# EAGLE design afe_revA (EAGLE 6.5.0)
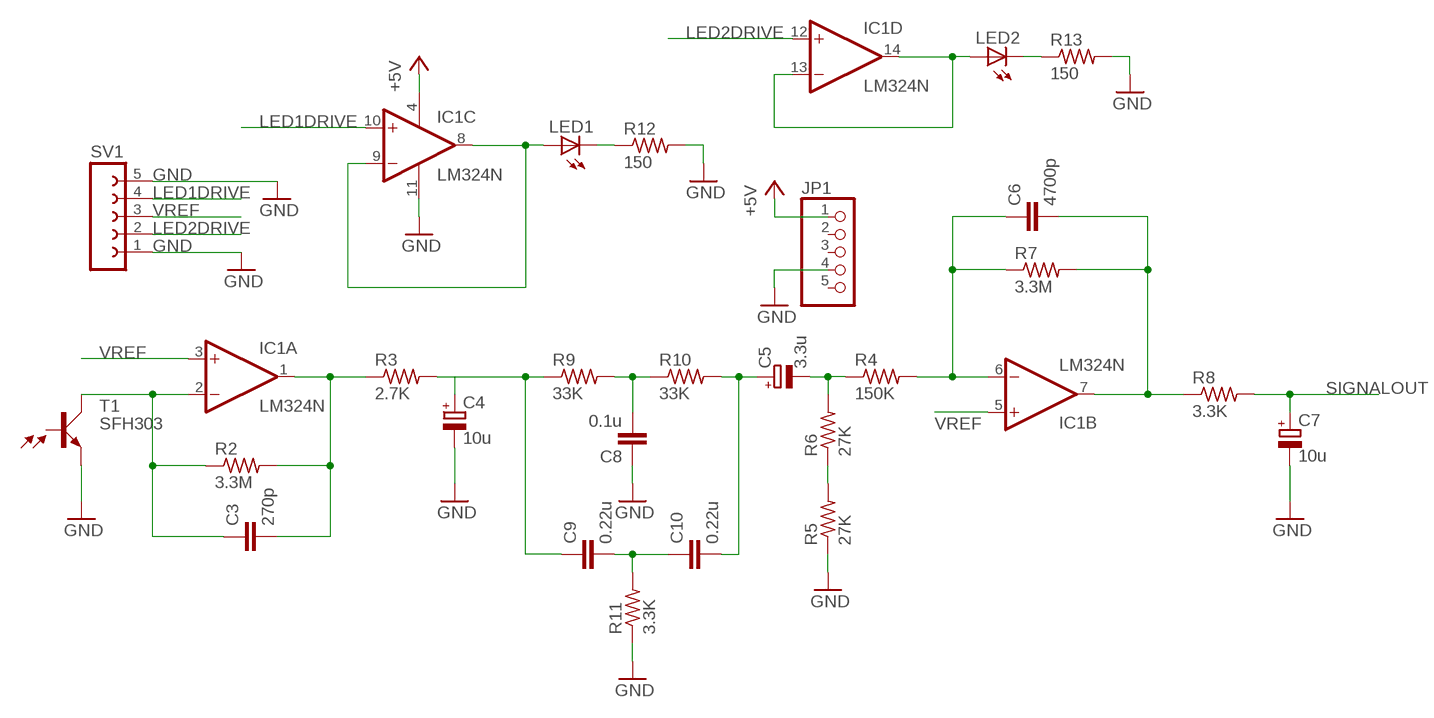
[diagram p0: schematic, sheet 1]

## Parts
C3  270p  C-EU025-024X044  [C025-024X044]
C4  10u  CPOL-EUE2.5-5  [E2,5-5]
C5  3.3u  CPOL-EUE2.5-5  [E2,5-5]
C6  4700p  C-EU025-024X044  [C025-024X044]
C7  10u  CPOL-EUE2.5-5  [E2,5-5]
C8  0.1u  C-EU025-024X044  [C025-024X044]
C9  0.22u  C-EU025-024X044  [C025-024X044]
C10  0.22u  C-EU025-024X044  [C025-024X044]
IC1  LM324N  [DIL14]
JP1  PINHD-1X5  [1X05]
LED1  LED5MM  [LED5MM]
LED2  LED5MM  [LED5MM]
R2  3.3M  R-US_0204/5  [0204/5]
R3  2.7K  R-US_0204/5  [0204/5]
R4  150K  R-US_0204/5  [0204/5]
R5  27K  R-US_0204/5  [0204/5]
R6  27K  R-US_0204/5  [0204/5]
R7  3.3M  R-US_0204/5  [0204/5]
R8  3.3K  R-US_0204/5  [0204/5]
R9  33K  R-US_0204/5  [0204/5]
R10  33K  R-US_0204/5  [0204/5]
R11  3.3K  R-US_0204/5  [0204/5]
R12  150  R-US_0204/5  [0204/5]
R13  150  R-US_0204/5  [0204/5]
SV1  FE05-1  [FE05-1]
T1  SFH303  [SFH303]

## Nets
+5V: IC1.4(P:V+) JP1.1
GND: C4.- C7.- C8.1 IC1.11(P:V-) JP1.4 R5.1 R11.1 R12.2 R13.2 SV1.1 SV1.5 T1.1(E)
LED1DRIVE: IC1.10(C:+IN) SV1.4
LED2DRIVE: IC1.12(D:+IN) SV1.2
N$1: C3.2 IC1.1(A:OUT) R2.2 R3.1
N$2: C3.1 IC1.2(A:-IN) R2.1 T1.2(C)
N$3: C4.+ C9.1 R3.2 R9.1
N$4: C5.- R4.1 R6.2
N$5: R5.2 R6.1
N$6: C6.1 IC1.6(B:-IN) R4.2 R7.1
N$7: C6.2 IC1.7(B:OUT) R7.2 R8.1
N$8: C8.2 R9.2 R10.1
N$9: C5.+ C10.2 R10.2
N$10: C9.2 C10.1 R11.2
N$11: IC1.13(D:-IN) IC1.14(D:OUT) LED2.A
N$12: IC1.8(C:OUT) IC1.9(C:-IN) LED1.A
N$13: LED1.K(C) R12.1
N$14: LED2.K(C) R13.1
SIGNALOUT: C7.+ R8.2
VREF: IC1.3(A:+IN) IC1.5(B:+IN) SV1.3
Unconnected: JP1.2 JP1.3 JP1.5 T1.3(B)

## Library data of the parts
C3 C6 C8-C10 = rcl:C-EU: CAPACITOR, European symbol
C4 C5 C7 = rcl:CPOL-EU: POLARIZED CAPACITOR, European symbol
IC1 = linear:LM324: OP AMP
JP1 = pinhead:PINHD-1X5: PIN HEADER
LED1 LED2 = led:LED: LED OSRAM: - CHIPLED LG R971, LG N971, LY N971, LG Q971, LY Q971, LO R971, LY R971 LH N974, LH R974 LS Q976, LO Q976, LY Q976 LO Q996 - Hyper CHIPLED LW Q18S LB Q993, LB Q99A, LB R99A - SideLED LS A670, LO A670, LY A670, LG A670, LP A670 LB A673, LV A673, LT A673, LW A673 LH A674 LY A675 LS A676, LA A676, LO A676, LY A676, LW A676 LS A679, LY A679, LG A679 - Hyper Micro SIDELED® LS Y876, LA Y876, LO Y876, LY Y876 LT Y87S - SmartLED LW L88C, LW L88S LB L89C, LB L89S, LG L890 LS L89K, LO L89K, LY L89K LS L896, LA L896, LO L896, LY L896 - TOPLED LS T670, LO T670, LY T670, LG T670, LP T670 LSG T670, LSP T670, LSY T670, LOP T670, LYG T670 LG T671, LOG T671, LSG T671 LB T673, LV T673, LT T673, LW T673 LH T674 LS T676, LA T676, LO T676, LY T676, LB T676, LH T676, LSB T676, LW T676 LB T67C, LV T67C, LT T67C, LS T67K, LO T67K, LY T67K, LW E67C LS E67B, LA E67B, LO E67B, LY E67B, LB E67C, LV E67C, LT E67C LW T67C LS T679, LY T679, LG T679 LS T770, LO T770, LY T770, LG T770, LP T770 LB T773, LV T773, LT T773, LW T773 LH T774 LS E675, LA E675, LY E675, LS T675 LS T776, LA T776, LO T776, LY T776, LB T776 LHGB T686 LT T68C, LB T68C - Hyper Mini TOPLED® LB M676 - Mini TOPLED Santana® LG M470 LS M47K, LO M47K, LY M47K Source: http://www.osram.convergy.de LUXEON: - LUMILED® LXK2-PW12-R00, LXK2-PW12-S00, LXK2-PW14-U00, LXK2-PW14-V00 LXK2-PM12-R00, LXK2-PM12-S00, LXK2-PM14-U00 LXK2-PE12-Q00, LXK2-PE12-R00, LXK2-PE12-S00, LXK2-PE14-T00, LXK2-PE14-U00 LXK2-PB12-K00, LXK2-PB12-L00, LXK2-PB12-M00, LXK2-PB14-N00, LXK2-PB14-P00, LXK2-PB14-Q00 LXK2-PR12-L00, LXK2-PR12-M00, LXK2-PR14-Q00, LXK2-PR14-R00 LXK2-PD12-Q00, LXK2-PD12-R00, LXK2-PD12-S00 LXK2-PH12-R00, LXK2-PH12-S00 LXK2-PL12-P00, LXK2-PL12-Q00, LXK2-PL12-R00 Source: www.luxeon.com KINGBRIGHT: KA-3528ASYC Source: www.kingbright.com
R2-R13 = rcl:R-US_: RESISTOR, American symbol
SV1 = con-lsta:FE05-1: FEMALE HEADER; OC_FARNELL: unknown; OC_NEWARK: unknown
T1 = opto-trans-siemens:SFH303: Silicium NPN Phototransistor Source: Siemens; OC_FARNELL: unknown; OC_NEWARK: unknown

## Board
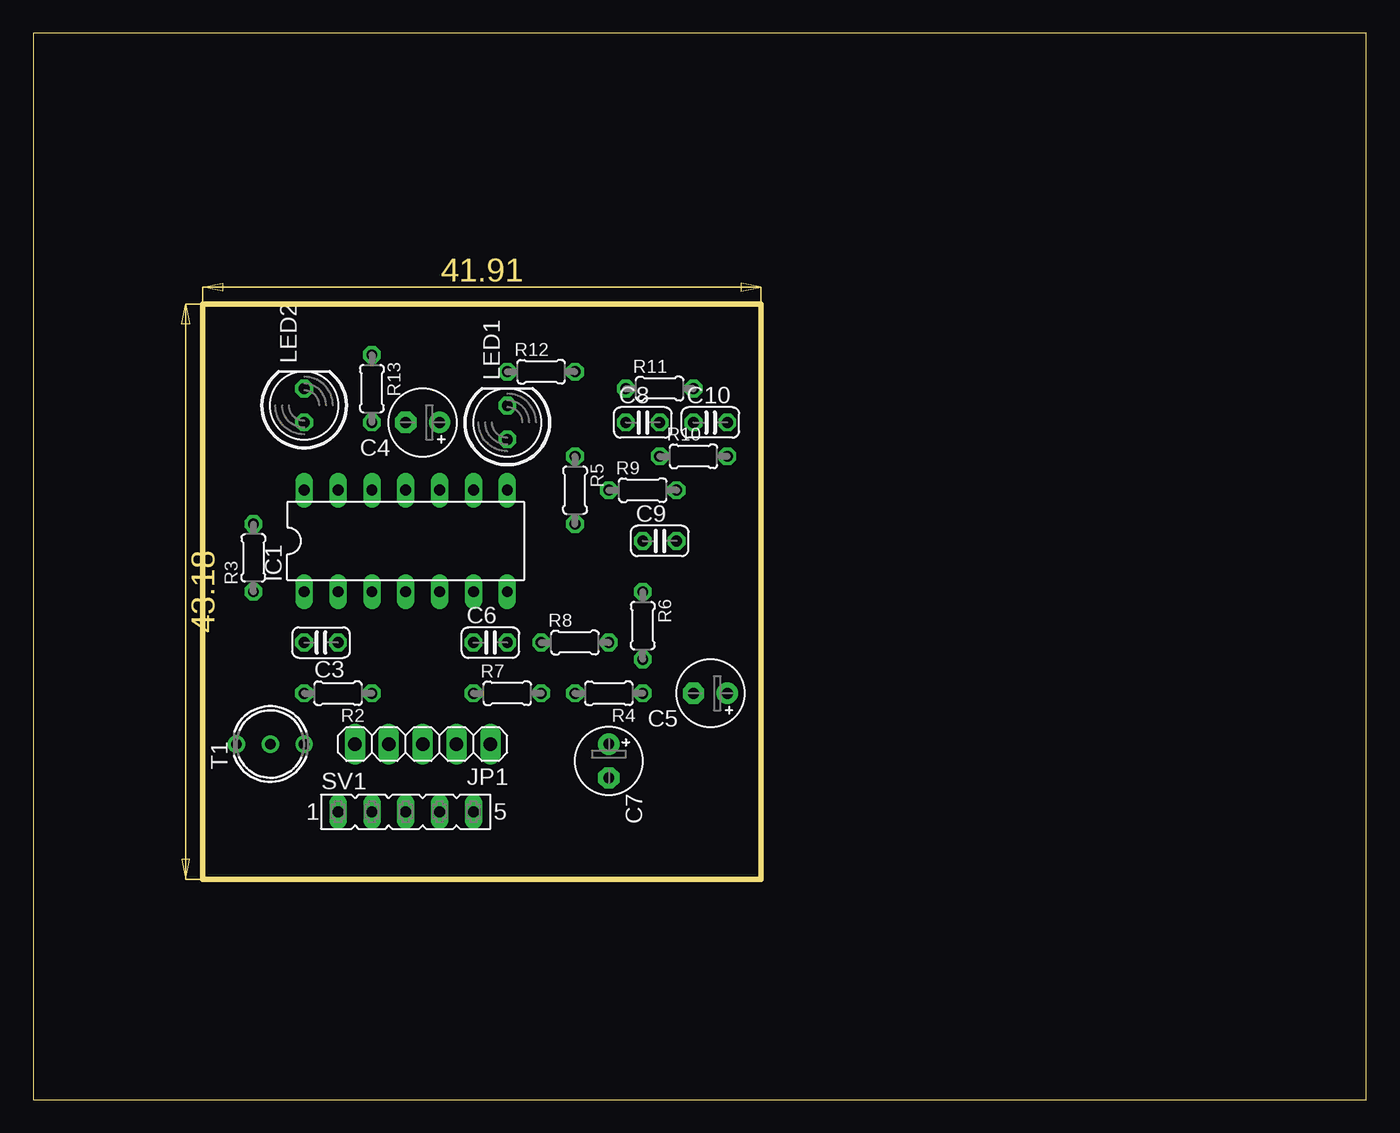
[diagram p1: board, top side]
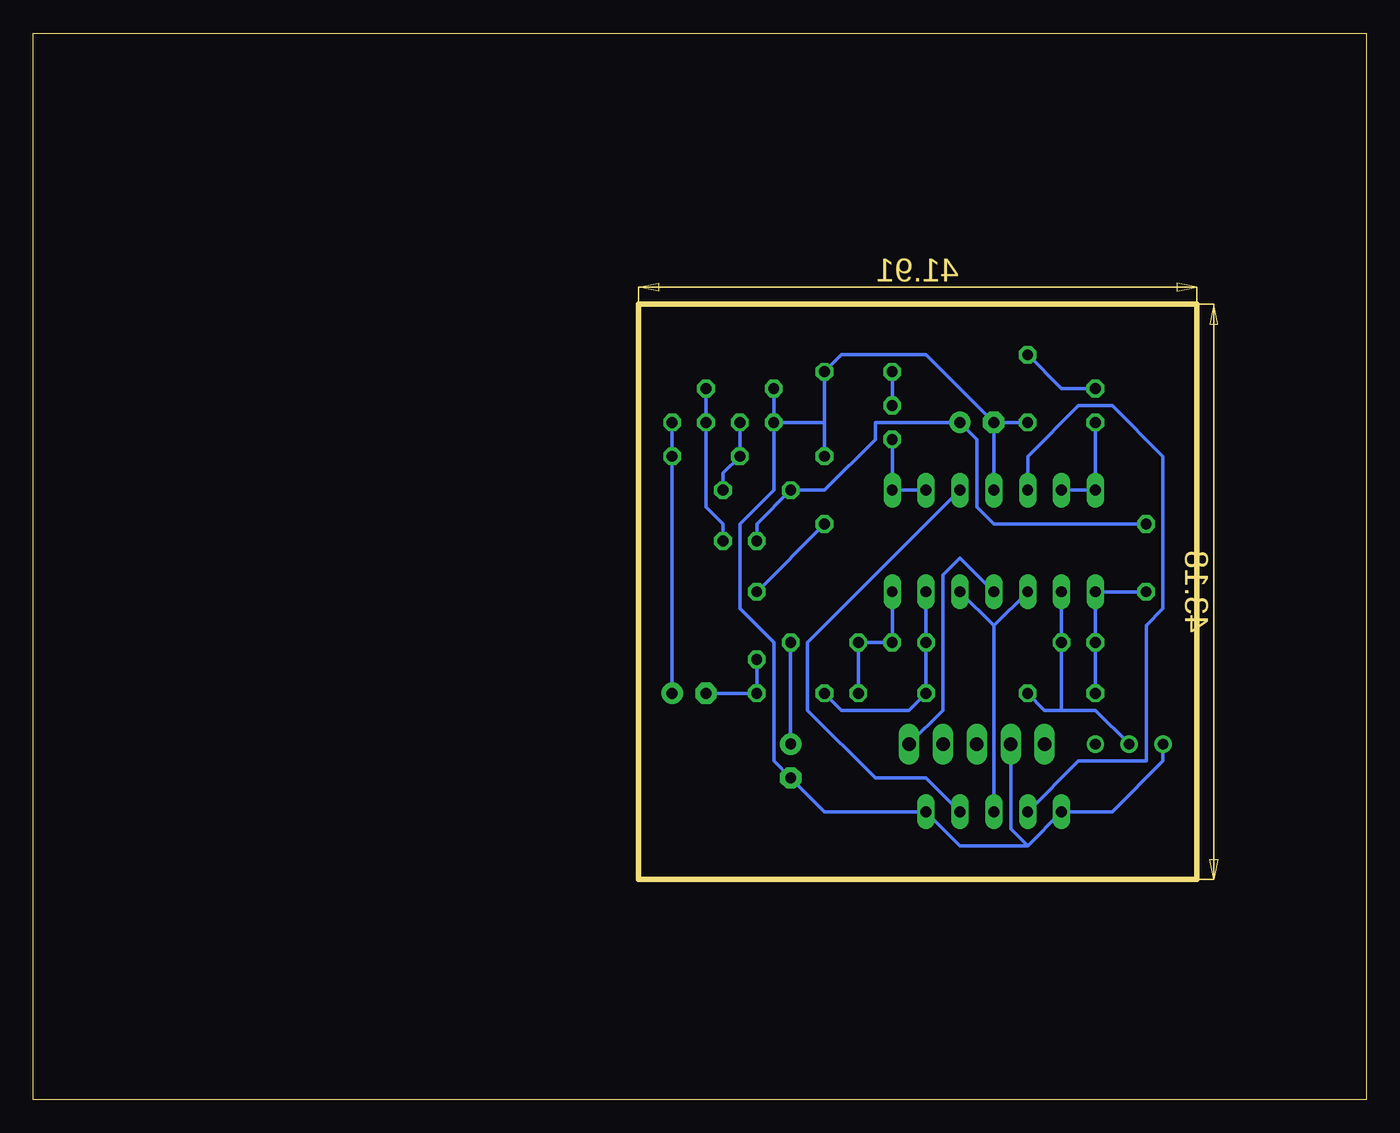
[diagram p2: board, bottom side, seen from below]

Size 100 x 80 mm. Coordinates in mm from the lower left corner, seen from the top.
Outline: 0,0 100,0 100,80 0,80 0,0
Outline: 12.7,16.51 54.61,16.51 54.61,59.69 12.7,59.69 12.7,16.51
Copper layers (1*16): Top 0.035mm / dielectric 1.5mm / Bottom 0.035mm
Design rules "default *": minimum track width 10mil, minimum drill 24mil, track to track 8mil, track to pad 8mil, pad to pad 8mil, via to via 8mil, smd to smd 8mil, copper to edge 40mil, drill to drill 8mil, minimum pad ring 10mil, minimum via ring 8mil, stop-mask expansion 4mil, vias tented up to drill 0mil, thermal gap 10mil

### Footprints (pad centres in the part's own frame; a part is rotated, then mirrored left to right if it is on the bottom)
C025-024X044 = drill 0.813 octagon: 1 -1.27,0; 2 1.27,0
E2,5-5 = drill 0.813 pad 1.6: + -1.27,0 | drill 0.813 pad 1.6 octagon: - 1.27,0
DIL14 = drill 0.813 long: 1 -7.62,-3.81; 2 -5.08,-3.81; 3 -2.54,-3.81; 4 0,-3.81; 5 2.54,-3.81; 6 5.08,-3.81; 7 7.62,-3.81; 8 7.62,3.81; 9 5.08,3.81; 10 2.54,3.81; 11 0,3.81; 12 -2.54,3.81; 13 -5.08,3.81; 14 -7.62,3.81
1X05 = drill 1.016 long: 1 -5.08,0; 2 -2.54,0; 3 0,0; 4 2.54,0; 5 5.08,0
LED5MM = drill 0.813 octagon: A -1.27,0; K 1.27,0
0204/5 = drill 0.813 octagon: 1 -2.54,0; 2 2.54,0
FE05-1 = drill 0.813 long: 1 -5.08,0; 2 -2.54,0; 3 0,0; 4 2.54,0; 5 5.08,0
SFH303 = drill 0.8 pad 1.3: 1 0,2.54; 2 0,0; 3 0,-2.54

### Placement (x,y rotation side)
C3  21.59,34.29 180 top
C4  29.21,50.8 180 top
C5  50.8,30.48 180 top
C6  34.29,34.29 0 top
C7  43.18,25.4 270 top
C8  45.72,50.8 0 top
C9  46.99,41.91 0 top
C10  50.8,50.8 0 top
IC1  27.94,41.91 0 top
JP1  29.21,26.67 180 top
LED1  35.56,50.8 90 top
LED2  20.32,52.07 90 top
R2  22.86,30.48 180 top
R3  16.51,40.64 90 top
R4  43.18,30.48 180 top
R5  40.64,45.72 270 top
R6  45.72,35.56 270 top
R7  35.56,30.48 0 top
R8  40.64,34.29 0 top
R9  45.72,45.72 0 top
R10  49.53,48.26 0 top
R11  46.99,53.34 0 top
R12  38.1,54.61 0 top
R13  25.4,53.34 270 top
SV1  27.94,21.59 0 top
T1  17.78,26.67 90 top

### Tracks (layer width: path | path; a pad name or v marks a point on that pad's centre or on a via)
+5V
  Bottom 0.254: IC1.4 30.48,40.64 31.75,39.37 31.75,29.21 JP1.1
GND
  Bottom 0.254: C4.- IC1.11 | C4.- R13.2 | R11.1 C8.1 | 40.64,50.8 R12.2 39.37,55.88 33.02,55.88 C4.- | 40.64,50.8 R5.1 | 40.64,50.8 C8.1 | T1.1 15.24,25.4 19.05,21.59 SV1.1 25.4,19.05 | JP1.4 26.67,20.32 25.4,19.05 | 25.4,19.05 30.48,19.05 SV1.5 40.64,21.59 C7.- 44.45,25.4 44.45,34.29 46.99,36.83 46.99,43.18 44.45,45.72 C8.1
LED1DRIVE
  Bottom 0.254: SV1.4 33.02,24.13 36.83,24.13 41.91,29.21 41.91,34.29 IC1.10
LED2DRIVE
  Bottom 0.254: SV1.2 21.59,25.4 16.51,25.4 16.51,35.56 15.24,36.83 15.24,48.26 19.05,52.07 21.59,52.07 25.4,48.26 IC1.12
N$1
  Bottom 0.254: R2.2 C3.2 IC1.1 R3.1
N$2
  Bottom 0.254: IC1.2 C3.1 22.86,29.21 | T1.2 20.32,29.21 22.86,29.21 | 22.86,29.21 24.13,29.21 R2.1
N$3
  Bottom 0.254: C9.1 45.72,43.18 R9.1 40.64,45.72 36.83,49.53 36.83,50.8 C4.+ 29.21,49.53 29.21,44.45 27.94,43.18 R3.2
N$4
  Bottom 0.254: R6.2 R4.1 C5.-
N$5
  Bottom 0.254: R5.2 R6.1
N$6
  Bottom 0.254: IC1.6 C6.1 R7.1 34.29,29.21 39.37,29.21 R4.2
N$7
  Bottom 0.254: R7.2 R8.1 C6.2 IC1.7
N$8
  Bottom 0.254: C8.2 R10.1 48.26,46.99 R9.2
N$9
  Bottom 0.254: C10.2 R10.2 C5.+
N$10
  Bottom 0.254: C9.2 48.26,43.18 49.53,44.45 C10.1 R11.2
N$11
  Bottom 0.254: IC1.13 IC1.14 LED2.A
N$12
  Bottom 0.254: IC1.9 IC1.8 LED1.A
N$13
  Bottom 0.254: R12.1 LED1.K
N$14
  Bottom 0.254: LED2.K 22.86,53.34 R13.1
SIGNALOUT
  Bottom 0.254: C7.+ R8.2
VREF
  Bottom 0.254: 27.94,35.56 SV1.3 | IC1.3 27.94,35.56 | 27.94,35.56 IC1.5